# EAGLE design Acc2BncBreakout (EAGLE 6.5.0)
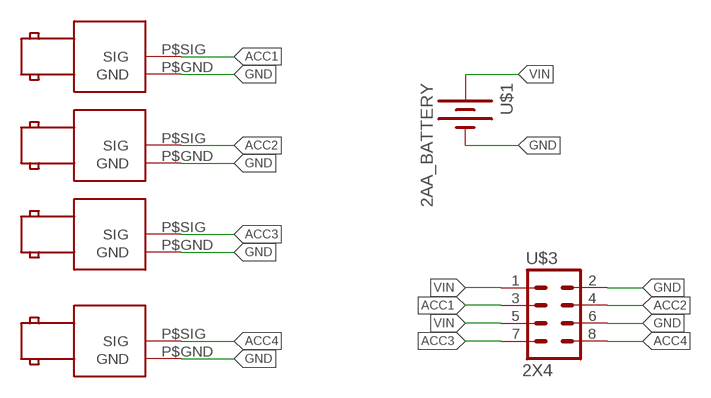
[diagram p0: schematic, sheet 1]

## Parts
ACC1  BNC_RIGHT_ANGLE  [BNC_RIGHT_ANGLE]
ACC2  BNC_RIGHT_ANGLE  [BNC_RIGHT_ANGLE]
ACC3  BNC_RIGHT_ANGLE  [BNC_RIGHT_ANGLE]
ACC4  BNC_RIGHT_ANGLE  [BNC_RIGHT_ANGLE]
U$1  2AA_BATTERY  [2AA_PLASTIC_HOLDER]
U$3  2X4  [2X4_SHROUDED_BERG]

## Nets
ACC1: ACC1.P$SIG(SIG) U$3.3
ACC2: ACC2.P$SIG(SIG) U$3.4
ACC3: ACC3.P$SIG(SIG) U$3.7
ACC4: ACC4.P$SIG(SIG) U$3.8
GND: ACC1.P$GND(GND) ACC2.P$GND(GND) ACC3.P$GND(GND) ACC4.P$GND(GND) U$1.PWR@4(-) U$3.2 U$3.6
VIN: U$1.PWR@3(+) U$3.1 U$3.5

## Library data of the parts
ACC1-ACC4 = connectors:BNC_RIGHT_ANGLE: BNC plug, through-hole, right-angle
U$1 = Pavel_ElectroMechanical:2AA_BATTERY
U$3 = Pavel_Connectors:2X4

## Board
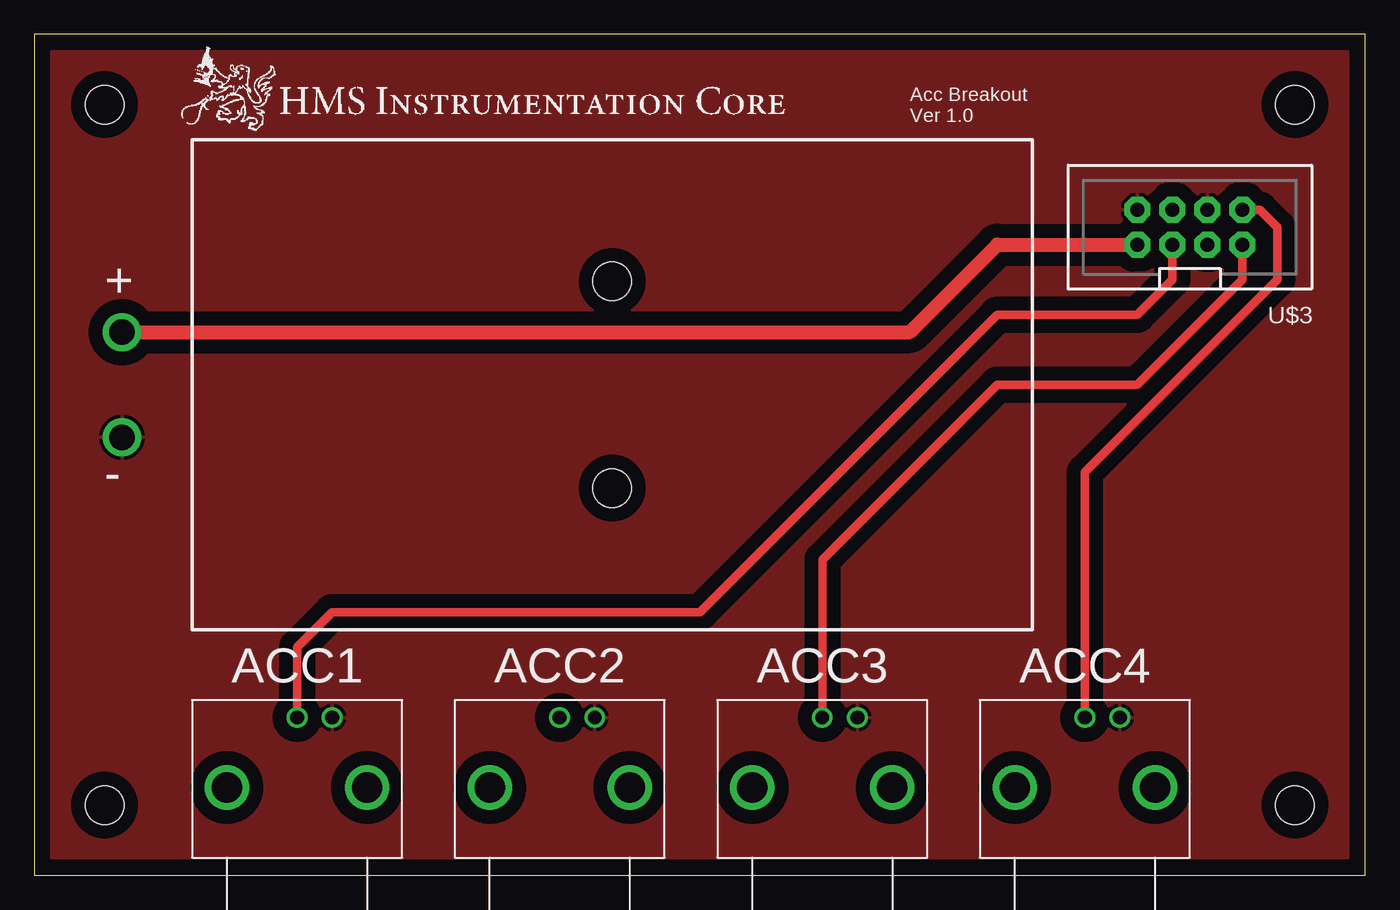
[diagram p1: board, top side]
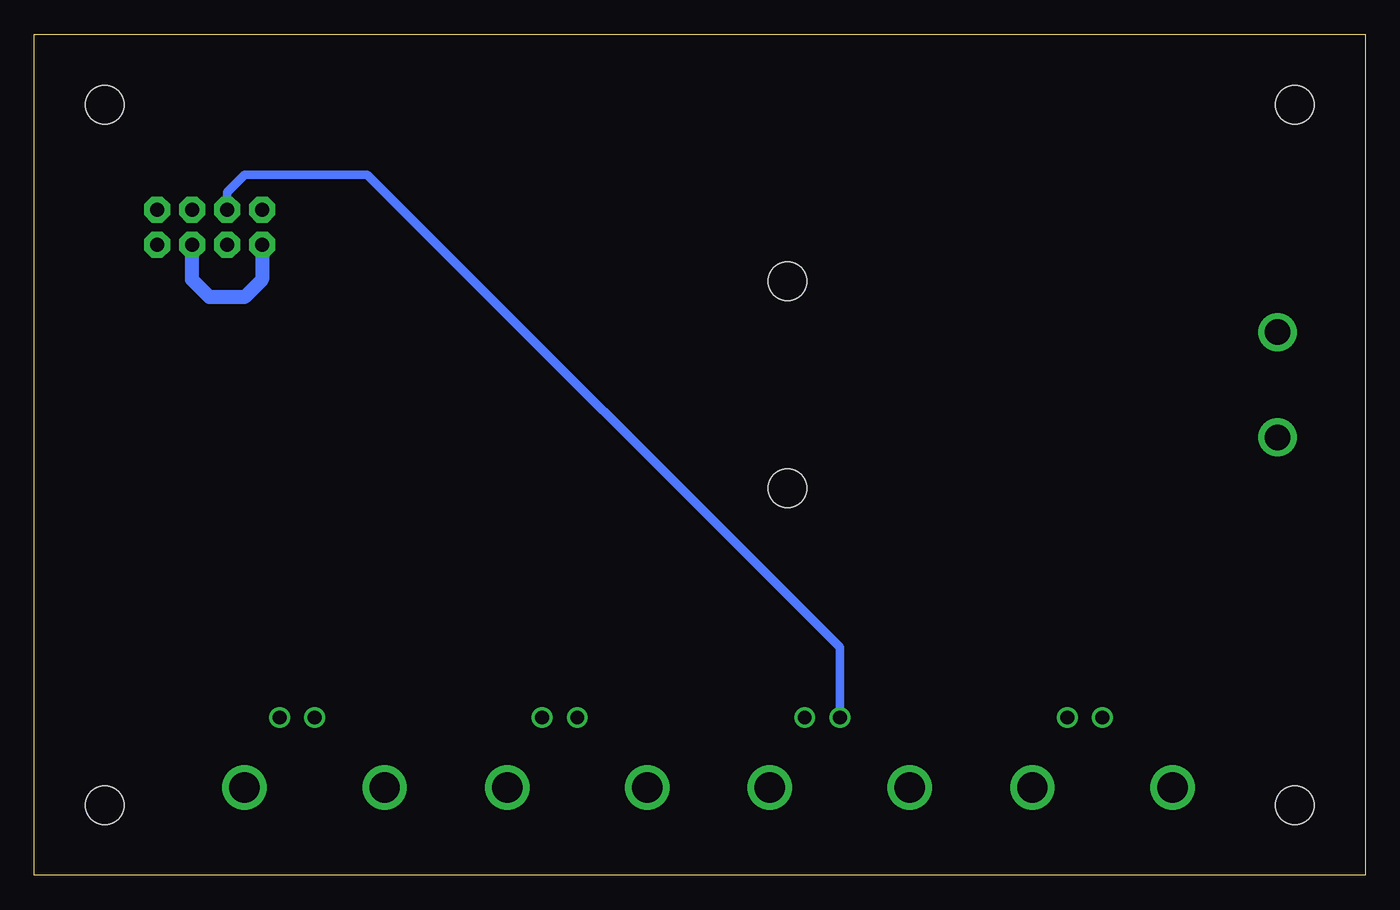
[diagram p2: board, bottom side, seen from below]

Size 96.52 x 60.96 mm. Coordinates in mm from the lower left corner, seen from the top.
Outline: 0,0 96.52,0 96.52,60.96 0,60.96 0,0
Copper layers (1*16): Top 0.035mm / dielectric 1.5mm / Bottom 0.035mm
Design rules "default": minimum track width 10mil, minimum drill 24mil, track to track 8mil, track to pad 8mil, pad to pad 8mil, via to via 8mil, smd to smd 8mil, copper to edge 40mil, drill to drill 8mil, minimum pad ring 10mil, minimum via ring 8mil, stop-mask expansion 4mil, vias tented up to drill 0mil, thermal gap 10mil
Holes 2.8 mm at 5.08,5.08 5.08,55.88 91.44,55.88 91.44,5.08

### Footprints (pad centres in the part's own frame; a part is rotated, then mirrored left to right if it is on the bottom)
BNC_RIGHT_ANGLE = drill 2.2: P$1 -5.08,-6.35; P$2 5.08,-6.35 | drill 1: P$GND -2.54,-11.43; P$SIG 0,-11.43
2AA_PLASTIC_HOLDER = drill 1.854: PWR@3 -35.56,3.81; PWR@4 -35.56,-3.81 | hole 2.8: 0,7.493; 0,-7.493
2X4_SHROUDED_BERG = drill 1.016 pad 1.88 octagon: 1 3.81,1.27; 2 3.81,-1.27; 3 1.27,1.27; 4 1.27,-1.27; 5 -1.27,1.27; 6 -1.27,-1.27; 7 -3.81,1.27; 8 -3.81,-1.27

### Placement (x,y rotation side)
ACC1  19.05,0 180 top
ACC2  38.1,0 180 top
ACC3  57.15,0 180 top
ACC4  76.2,0 180 top
U$1  41.91,35.56 0 top
U$3  83.82,46.99 180 top

### Tracks (layer width: path | path; a pad name or v marks a point on that pad's centre or on a via)
ACC1
  Top 0.61: U$3.3 82.55,43.18 80.01,40.64 69.85,40.64 48.26,19.05 21.59,19.05 19.05,16.51 ACC1.P$SIG
ACC2
  Bottom 0.61: U$3.4 82.55,49.53 81.28,50.8 72.39,50.8 38.1,16.51 ACC2.P$SIG
ACC3
  Top 0.61: U$3.7 87.63,43.18 80.01,35.56 69.85,35.56 57.15,22.86 ACC3.P$SIG
ACC4
  Top 0.61: U$3.8 88.9,48.26 90.17,46.99 90.17,43.18 76.2,29.21 ACC4.P$SIG
GND
  pour Top (isolate 1.016): 1.27,1.27 1.27,59.69 95.25,59.69 95.25,1.27
VIN
  Top 1.016: U$1.PWR@3 63.5,39.37 69.85,45.72 U$3.1
  Bottom 1.016: U$3.1 80.01,43.18 81.28,41.91 83.82,41.91 85.09,43.18 U$3.5

### Text on the board
tPlace: Acc Breakout / Ver 1.0